# EAGLE design ValveDriver-8ch (EAGLE 9.1.1)
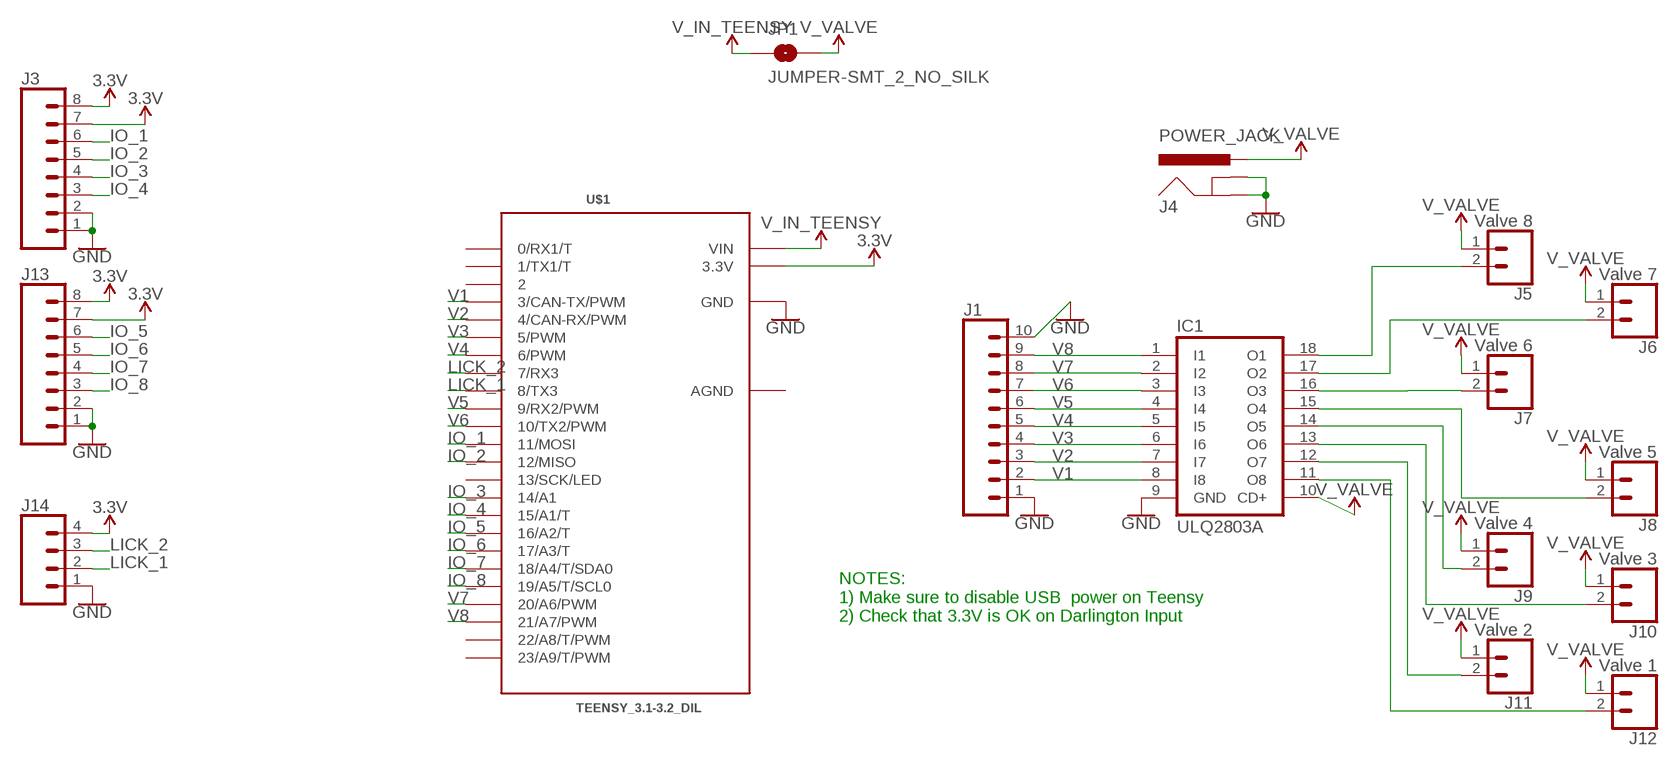
[diagram p0: schematic, sheet 1]

## Parts
IC1  ULQ2803A  ULN2803A  [DIL18]
J1  CONN_10"  [1X10]
J3  CONN_083.5MM-8  [SCREWTERMINAL-3.5MM-8]
J4  POWER_JACK  [POWER_JACK_PTH]
J5  Valve 8  CONN_02  [1X02]
J6  Valve 7  CONN_02  [1X02]
J7  Valve 6  CONN_02  [1X02]
J8  Valve 5  CONN_02  [1X02]
J9  Valve 4  CONN_02  [1X02]
J10  Valve 3  CONN_02  [1X02]
J11  Valve 2  CONN_02  [1X02]
J12  Valve 1  CONN_02  [1X02]
J13  CONN_083.5MM-8  [SCREWTERMINAL-3.5MM-8]
J14  CONN_04  [1X04]
JP1  JUMPER-SMT_2_NO_SILK  [SMT-JUMPER_2_NO_SILK]
U$1  TEENSY_3.1-3.2_DIL  [TEENSY_3.0-3.2&LC_DIL]

## Nets
3.3V: J3.7 J3.8 J13.7 J13.8 J14.4 U$1.3.3V
GND [power]: IC1.9(GND) J1.1 J1.10 J3.1 J3.2 J4.GND J4.GNDBREAK J13.1 J13.2 J14.1 U$1.GND
IO_1: J3.6 U$1.11(11/MOSI)
IO_2: J3.5 U$1.12(12/MISO)
IO_3: J3.4 U$1.14/A0(14/A1)
IO_4: J3.3 U$1.15/A1(15/A1/T)
IO_5: J13.6 U$1.16/A2(16/A2/T)
IO_6: J13.5 U$1.17/A3(17/A3/T)
IO_7: J13.4 U$1.18/A4(18/A4/T/SDA0)
IO_8: J13.3 U$1.19/A5(19/A5/T/SCL0)
LICK_1: J14.2 U$1.8(8/TX3)
LICK_2: J14.3 U$1.7(7/RX3)
N$1 [power]: IC1.18(O1) J5.2
N$2 [power]: IC1.17(O2) J6.2
N$3 [power]: IC1.16(O3) J7.2
N$4 [power]: IC1.15(O4) J8.2
N$5 [power]: IC1.14(O5) J9.2
N$6 [power]: IC1.13(O6) J10.2
N$7 [power]: IC1.12(O7) J11.2
N$8 [power]: IC1.11(O8) J12.2
V1: IC1.8(I8) J1.2 U$1.3(3/CAN-TX/PWM)
V2: IC1.7(I7) J1.3 U$1.4(4/CAN-RX/PWM)
V3: IC1.6(I6) J1.4 U$1.5(5/PWM)
V4: IC1.5(I5) J1.5 U$1.6(6/PWM)
V5: IC1.4(I4) J1.6 U$1.9(9/RX2/PWM)
V6: IC1.3(I3) J1.7 U$1.10(10/TX2/PWM)
V7: IC1.2(I2) J1.8 U$1.20/A6(20/A6/PWM)
V8: IC1.1(I1) J1.9 U$1.21/A7(21/A7/PWM)
V_IN_TEENSY: JP1.1 U$1.VIN
V_VALVE [power]: IC1.10(CD+) J4.PWR J5.1 J6.1 J7.1 J8.1 J9.1 J10.1 J11.1 J12.1 JP1.2
Unconnected: U$1.0(0/RX1/T) U$1.1(1/TX1/T) U$1.2 U$1.13(13/SCK/LED) U$1.22/A8(22/A8/T/PWM) U$1.23/A9(23/A9/T/PWM)

## Notes on the sheet
- NOTES:
  1) Make sure to disable USB  power on Teensy
  2) Check that 3.3V is OK on Darlington Input

## Power pins joined to a net without a drawn wire
AGND: U$1.AGND

## Library data of the parts
IC1 = uln-udn:ULN2803A: DRIVER ARRAY
J1 = SparkFun-Connectors:CONN_10: Multi connection point. Often used as Generic Header-pin footprint for 0.1 inch spaced/style header connections On any of the 0.1 inch spaced packages, you can populate with these: Break Away Headers - Straight <https://www.sparkfun.com/products/116> (PRT-00116) Break Away Male Headers - Right Angle <https://www.sparkfun.com/products/553> (PRT-00553) Female Headers <https://www.sparkfun.com/products/115> (PRT-00115) Break Away Headers - Machine Pin <https://www.sparkfun.com/products/117> (PRT-00117) Break Away Female Headers - Swiss Machine Pin <https://www.sparkfun.com/products/743> (PRT-00743) Arduino Stackable Header - 10 Pin <https://www.sparkfun.com/products/11376> (PRT-11376) For SCREWTERMINALS and SPRING TERMINALS visit here: Screw Terimnals on SparkFun.com <https://www.sparkfun.com/search/results?term=Screw+Terminals> (5mm/3.5mm/2.54mm spacing) This device is also useful as a general connection point to wire up your design to another part of your project. Our various solder wires solder well into these plated through hole pads. Hook-Up Wire - Assortment (Stranded, 22 AWG) <https://www.sparkfun.com/products/11375> (PRT-11375) Hook-Up Wire - Assortment (Solid Core, 22 AWG) <https://www.sparkfun.com/products/11367> (PRT-11367) View the entire wire category on our website here <https://www.sparkfun.com/categories/141> Special notes: Molex polarized connector foot print use with SKU : PRT-08231 with associated crimp pins and housings. 1MM SMD Version SKU: PRT-10208 NOTES ON THE VARIANTS LOCK and LOCK_LONGPADS... This footprint was designed to help hold the alignment of a through-hole component (i.e. 6-pin header) while soldering it into place. You may notice that each hole has been shifted either up or down by 0.005 of an inch from it's more standard position (which is a perfectly straight line). This slight alteration caused the pins (the squares in the middle) to touch the edges of the holes. Because they are alternating, it causes a "brace" to hold the component in place. 0.005 has proven to be the perfect amount of "off-center" position when using our standard breakaway headers. Although looks a little odd when you look at the bare footprint, once you have a header in there, the alteration is very hard to notice. Also,if you push a header all the way into place, it is covered up entirely on the bottom side.; PROD_ID: CONN-11563
J3 J13 = SparkFun-Connectors:CONN_08: Multi connection point. Often used as Generic Header-pin footprint for 0.1 inch spaced/style header connections On any of the 0.1 inch spaced packages, you can populate with these: Break Away Headers - Straight <https://www.sparkfun.com/products/116> (PRT-00116) Break Away Male Headers - Right Angle <https://www.sparkfun.com/products/553> (PRT-00553) Female Headers <https://www.sparkfun.com/products/115> (PRT-00115) Break Away Headers - Machine Pin <https://www.sparkfun.com/products/117> (PRT-00117) Break Away Female Headers - Swiss Machine Pin <https://www.sparkfun.com/products/743> (PRT-00743) Arduino Stackable Header - 8 Pin <https://www.sparkfun.com/products/9279> (PRT-09279) For SCREWTERMINALS and SPRING TERMINALS visit here: Screw Terimnals on SparkFun.com <https://www.sparkfun.com/search/results?term=Screw+Terminals> (5mm/3.5mm/2.54mm spacing) This device is also useful as a general connection point to wire up your design to another part of your project. Our various solder wires solder well into these plated through hole pads. Hook-Up Wire - Assortment (Stranded, 22 AWG) <https://www.sparkfun.com/products/11375> (PRT-11375) Hook-Up Wire - Assortment (Solid Core, 22 AWG) <https://www.sparkfun.com/products/11367> (PRT-11367) View the entire wire category on our website here <https://www.sparkfun.com/categories/141> Special notes: Molex polarized connector foot print use with SKU : PRT-08231 with associated crimp pins and housings. 1MM SMD Version SKU: PRT-10208 NOTES ON THE VARIANTS LOCK and LOCK_LONGPADS... This footprint was designed to help hold the alignment of a through-hole component (i.e. 6-pin header) while soldering it into place. You may notice that each hole has been shifted either up or down by 0.005 of an inch from it's more standard position (which is a perfectly straight line). This slight alteration caused the pins (the squares in the middle) to touch the edges of the holes. Because they are alternating, it causes a "brace" to hold the component in place. 0.005 has proven to be the perfect amount of "off-center" position when using our standard breakaway headers. Although looks a little odd when you look at the bare footprint, once you have a header in there, the alteration is very hard to notice. Also,if you push a header all the way into place, it is covered up entirely on the bottom side.
J4 = SparkFun-Connectors:POWER_JACK: Power Jack Connector This is the standard 5.5mm barrel jack for power. The PTH is the most common, proven, reliable, footprint. The Slot footprint only works if the mill layer is transmitted to the PCB fab house so be warned. Here are the connectors we sell at SparkFun: DC Barrel Power Jack/Connector <https://www.sparkfun.com/products/119> (PRT-00119) DC Barrel Power Jack/Connector (SMD) <https://www.sparkfun.com/products/12748> (PRT-12748) DC Barrel Jack Adapter - Breadboard Compatible <https://www.sparkfun.com/products/10811> (PRT-10811) It is used on this SparkFun product (and many, many others): SparkFun RedBoard - Programmed with Arduino <https://www.sparkfun.com/products/12757> (DEV-12757) Also, if you need a mating power supply or connector, please check these out: Wall Adapter Power Supply - 9VDC 650mA <https://www.sparkfun.com/products/298> (TOL-00298) DC Barrel Jack Adapter - Male <https://www.sparkfun.com/products/10287> (PRT-10287); PROD_ID: CONN-08197
J5-J12 = SparkFun-Connectors:CONN_02: Multi connection point. Often used as Generic Header-pin footprint for 0.1 inch spaced/style header connections On any of the 0.1 inch spaced packages, you can populate with these: Break Away Headers - Straight <https://www.sparkfun.com/products/116> (PRT-00116) Break Away Male Headers - Right Angle <https://www.sparkfun.com/products/553> (PRT-00553) Female Headers <https://www.sparkfun.com/products/115> (PRT-00115) Break Away Headers - Machine Pin <https://www.sparkfun.com/products/117> (PRT-00117) Break Away Female Headers - Swiss Machine Pin <https://www.sparkfun.com/products/743> (PRT-00743) For SCREWTERMINALS and SPRING TERMINALS visit here: Screw Terimnals on SparkFun.com <https://www.sparkfun.com/search/results?term=Screw+Terminals> (5mm/3.5mm/2.54mm spacing) This device is also useful as a general connection point to wire up your design to another part of your project. Our various solder wires solder well into these plated through hole pads. Hook-Up Wire - Assortment (Stranded, 22 AWG) <https://www.sparkfun.com/products/11375> (PRT-11375) Hook-Up Wire - Assortment (Solid Core, 22 AWG) <https://www.sparkfun.com/products/11367> (PRT-11367) View the entire wire category on our website here <https://www.sparkfun.com/categories/141> Special notes: Molex polarized connector foot print use with: PRT-08233 with associated crimp pins and housings. 2.54_SCREWTERM for use with PRT-10571. 3.5mm Screw Terminal footprints for PRT-08084 5mm Screw Terminal footprints for use with PRT-08432
J14 = SparkFun-Connectors:CONN_04: Multi connection point. Often used as Generic Header-pin footprint for 0.1 inch spaced/style header connections On any of the 0.1 inch spaced packages, you can populate with these: Break Away Headers - Straight <https://www.sparkfun.com/products/116> (PRT-00116) Break Away Male Headers - Right Angle <https://www.sparkfun.com/products/553> (PRT-00553) Female Headers <https://www.sparkfun.com/products/115> (PRT-00115) Break Away Headers - Machine Pin <https://www.sparkfun.com/products/117> (PRT-00117) Break Away Female Headers - Swiss Machine Pin <https://www.sparkfun.com/products/743> (PRT-00743) For SCREWTERMINALS and SPRING TERMINALS visit here: Screw Terimnals on SparkFun.com <https://www.sparkfun.com/search/results?term=Screw+Terminals> (5mm/3.5mm/2.54mm spacing) This device is also useful as a general connection point to wire up your design to another part of your project. Our various solder wires solder well into these plated through hole pads. Hook-Up Wire - Assortment (Stranded, 22 AWG) <https://www.sparkfun.com/products/11375> (PRT-11375) Hook-Up Wire - Assortment (Solid Core, 22 AWG) <https://www.sparkfun.com/products/11367> (PRT-11367) View the entire wire category on our website here <https://www.sparkfun.com/categories/141> Special notes: Molex polarized connector foot print use with SKU : PRT-08231 with associated crimp pins and housings. 1MM SMD Version SKU: PRT-10208; PROD_ID: CONN-09696
JP1 = SparkFun-Jumpers:JUMPER-SMT_2_NO: Normally open jumper This jumper has two pads in close proximity to each other. Apply solder to close the connection. Round pads are easier to solder for beginners, but are a lot larger. SparkFun Product that uses the round pads: SparkFun EL Sequencer <https://www.sparkfun.com/products/12781>
U$1 = Teensy_3_and_LC_Series_Boards_v1.4:TEENSY_3.1-3.2_DIL: Teensy 3.1 or 3.2 in a DIL Layout.

## Net classes
0 default: width 0.305 mm, clearance 0.305 mm
1 power: width 0.61 mm, clearance 0.254 mm

## Board
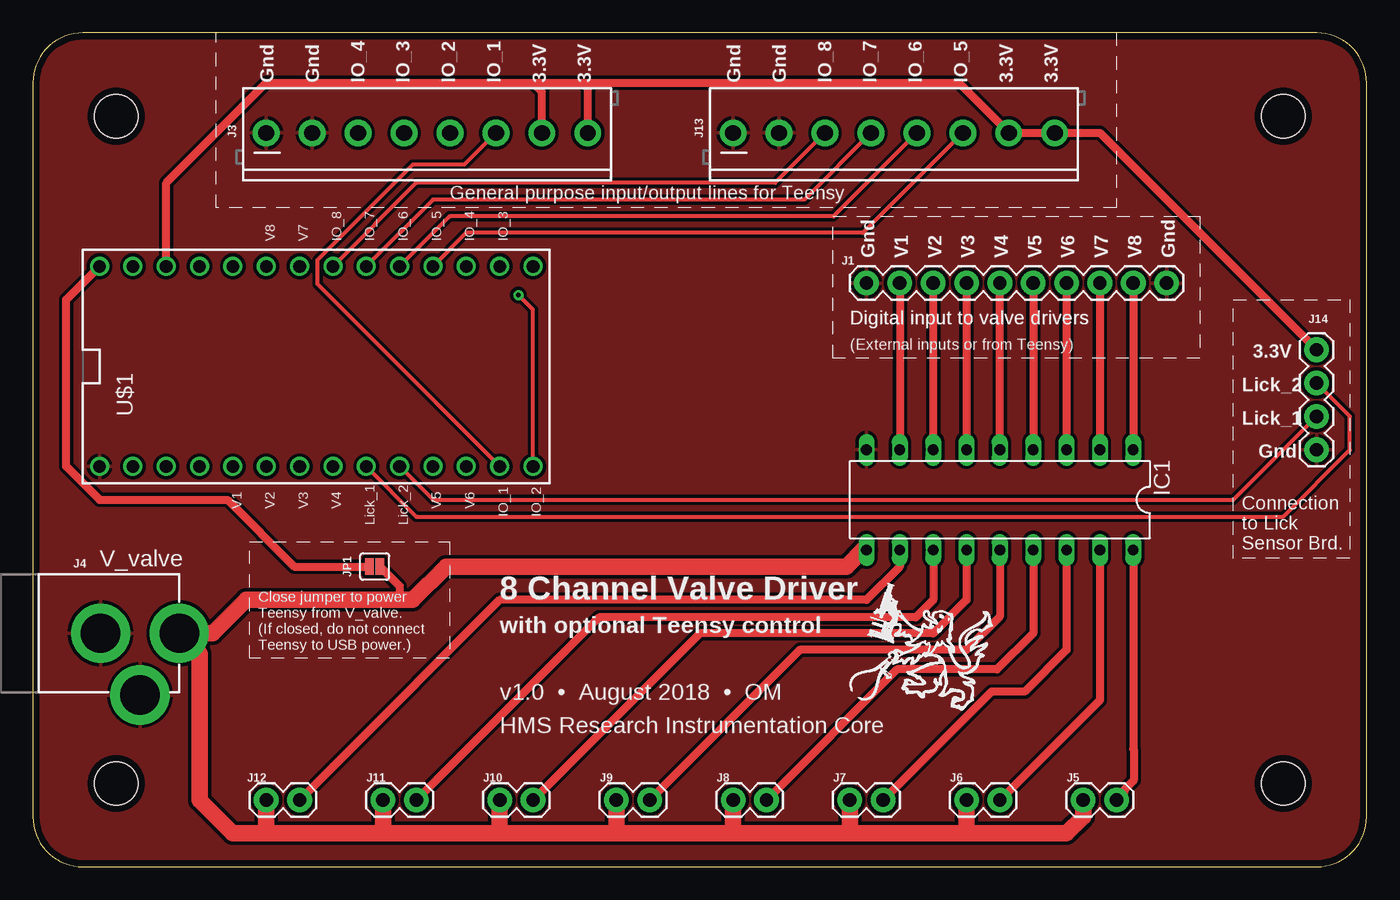
[diagram p1: board, top side]
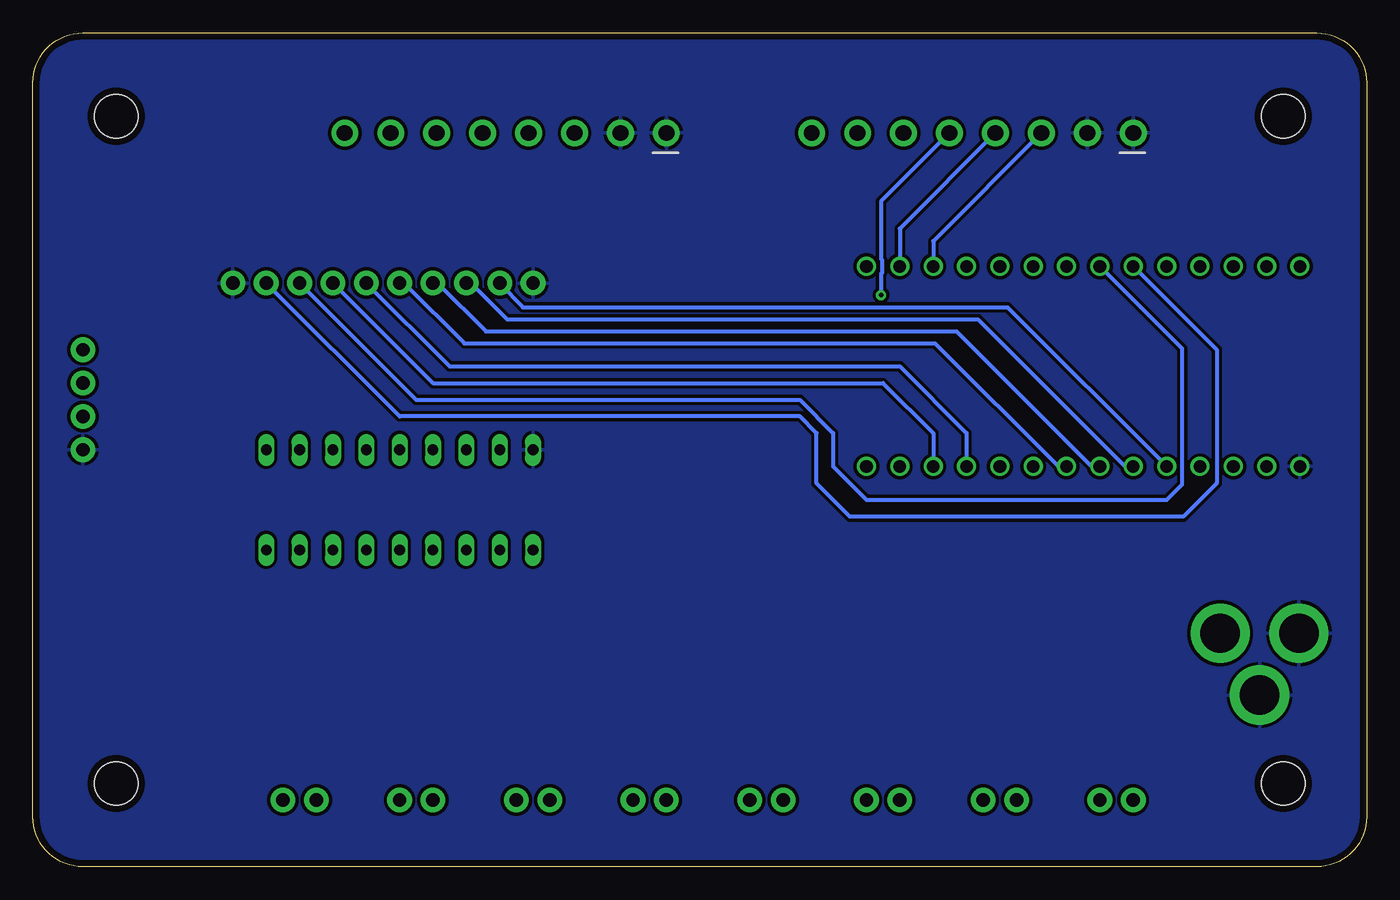
[diagram p2: board, bottom side, seen from below]

Size 101.6 x 63.5 mm. Coordinates in mm from the lower left corner, seen from the top.
Outline: 0,59.69 0,3.81 arc90 3.81,0 97.79,0 arc90 101.6,3.81 101.6,59.69 arc90 97.79,63.5 3.81,63.5 arc90 0,59.69
Copper layers (1*16): Top 0.0178mm / dielectric 59mil / Bottom 0.0178mm
Design rules "SSC-EAGLE-2Lyr_v1.0.0.3": minimum track width 6mil, minimum drill 14mil, track to track 6mil, track to pad 6mil, pad to pad 6mil, via to via 6mil, smd to smd 6mil, copper to edge 20mil, drill to drill 16mil, minimum pad ring 8mil, minimum via ring 8mil, stop-mask expansion 3mil, vias tented up to drill 0mil, thermal gap 10mil

### Footprints (pad centres in the part's own frame; a part is rotated, then mirrored left to right if it is on the bottom)
DIL18 = drill 0.813 long: 1 -10.16,-3.81; 2 -7.62,-3.81; 3 -5.08,-3.81; 4 -2.54,-3.81; 5 0,-3.81; 6 2.54,-3.81; 7 5.08,-3.81; 8 7.62,-3.81; 9 10.16,-3.81; 10 10.16,3.81; 11 7.62,3.81; 12 5.08,3.81; 13 2.54,3.81; 14 0,3.81; 15 -2.54,3.81; 16 -5.08,3.81; 17 -7.62,3.81; 18 -10.16,3.81
1X10 = drill 1.016 pad 1.88: 1 0,0; 2 2.54,0; 3 5.08,0; 4 7.62,0; 5 10.16,0; 6 12.7,0; 7 15.24,0; 8 17.78,0; 9 20.32,0; 10 22.86,0
SCREWTERMINAL-3.5MM-8 = drill 1.2 pad 2.032: 1 0,0; 2 3.5,0; 3 7,0; 4 10.5,0; 5 14,0; 6 17.5,0; 7 21,0; 8 24.5,0
POWER_JACK_PTH = drill 2.997 pad 4.318: GND 0,7.7; GNDBREAK 4.7,10.7; PWR 0,13.7
1X02 = drill 1.016 pad 1.88: 1 0,0; 2 2.54,0
1X04 = drill 1.016 pad 1.88: 1 0,0; 2 2.54,0; 3 5.08,0; 4 7.62,0
SMT-JUMPER_2_NO_SILK = smd 0.635 x 1.27: 1 -0.406,0; 2 0.406,0
TEENSY_3.0-3.2&LC_DIL = drill 0.965: 0 -7.62,13.97; 1 -7.62,11.43; 2 -7.62,8.89; 3 -7.62,6.35; 3.3V 7.62,11.43; 4 -7.62,3.81; 5 -7.62,1.27; 6 -7.62,-1.27; 7 -7.62,-3.81; 8 -7.62,-6.35; 9 -7.62,-8.89; 10 -7.62,-11.43; 11 -7.62,-13.97; 12 -7.62,-16.51; 13 7.62,-16.51; 14/A0 7.62,-13.97; 15/A1 7.62,-11.43; 16/A2 7.62,-8.89; 17/A3 7.62,-6.35; 18/A4 7.62,-3.81; 19/A5 7.62,-1.27; 20/A6 7.62,1.27; 21/A7 7.62,3.81; 22/A8 7.62,6.35; 23/A9 7.62,8.89; AGND 7.62,13.97; GND -7.62,16.51; VIN 7.62,16.51
STAND-OFF = hole 3.302: 0,0

### Placement (x,y rotation side)
IC1  73.66,27.94 180 top
J1  63.5,44.45 0 top
J3  17.78,55.88 0 top
J4  -2.54,17.78 270 top
J5  80.01,5.08 0 top
J6  71.12,5.08 0 top
J7  62.23,5.08 0 top
J8  53.34,5.08 0 top
J9  44.45,5.08 0 top
J10  35.56,5.08 0 top
J11  26.67,5.08 0 top
J12  17.78,5.08 0 top
J13  53.34,55.88 0 top
J14  97.79,31.75 90 top
JP1  26.04,22.86 0 top
U$1  21.59,38.1 90 top
U$2  [STAND-OFF]  95.25,57.15 0 top
U$3  [RIC_LOGO_MED]  62.23,11.89 0 top
U$4  [STAND-OFF]  95.25,6.35 0 top
U$5  [STAND-OFF]  6.35,6.35 0 top
U$6  [STAND-OFF]  6.35,57.15 0 top

### Tracks (layer width: path | path; a pad name or v marks a point on that pad's centre or on a via)
3.3V
  Top 0.61: U$1.3.3V 10.16,52.07 17.78,59.69 38.1,59.69 | 38.1,59.69 41.91,59.69 | 41.91,59.69 70.53,59.69 J13.7 J13.8 81.28,55.88 J14.4 | J3.7 38.78,59.01 38.1,59.69 | J3.8 42.28,59.32 41.91,59.69
GND
  pour Bottom: 0,63.5 101.6,63.5 101.6,0 0,0
  pour Top: 0,63.5 101.6,63.5 101.6,0 0,0
IO_1
  Top 0.305: U$1.11 21.68,44.36 21.68,46.21 28.93,53.46 32.86,53.46 J3.6
IO_2  (via drill 0.36)
  Top 0.305: v36.99,43.53 38.1,42.42 U$1.12
  Bottom 0.305: J3.5 36.99,50.67 36.99,46.28 36.92,46.21 36.92,45.23 36.99,45.16 v36.99,43.53
IO_3
  Bottom 0.305: J3.4 35.56,48.6 U$1.14/A0
IO_4
  Bottom 0.305: J3.3 33.02,47.64 U$1.15/A1
IO_5
  Top 0.305: J13.6 63.22,48.26 33.02,48.26 U$1.16/A2
IO_6
  Top 0.305: J13.5 60.99,49.53 31.75,49.53 U$1.17/A3
IO_7
  Top 0.305: J13.4 58.76,50.8 30.48,50.8 U$1.18/A4
IO_8
  Top 0.305: J13.3 56.53,52.07 29.21,52.07 U$1.19/A5
LICK_1
  Top 0.305: U$1.8 30.48,27.94 91.44,27.94 J14.2
LICK_2
  Top 0.305: U$1.7 29.21,26.67 95.25,26.67 100.33,31.75 100.33,34.29 J14.3
N$1
  Top 0.61: IC1.18 83.82,8.97 83.86,8.93 83.86,6.58 83.13,5.85 83.13,5.66 J5.2
N$2
  Top 0.61: IC1.17 81.28,12.7 J6.2
N$3
  Top 0.61: IC1.16 78.74,16.51 75.56,13.34 73.03,13.34 J7.2
N$4
  Top 0.61: IC1.15 76.2,17.78 73.45,15.03 65.83,15.03 J8.2
N$5
  Top 0.61: IC1.14 73.66,19.05 71.12,16.51 58.42,16.51 J9.2
N$6
  Top 0.61: IC1.13 71.12,20.32 68.58,17.78 50.8,17.78 J10.2
N$7
  Top 0.61: IC1.12 68.58,20.32 67.26,19 43.13,19 J11.2
N$8
  Top 0.61: IC1.11 66.04,22.86 63.5,20.32 35.56,20.32 22.86,7.62 J12.2
V1
  Top 0.61: J1.2 IC1.8
  Bottom 0.305: U$1.3 27.36,42.6 64.27,42.6 J1.2
V2
  Top 0.61: IC1.7 J1.3
  Bottom 0.305: J1.3 68.23,44.45 65.46,41.68 29.62,41.68 18.42,30.48 U$1.4
V3
  Top 0.61: J1.4 IC1.6
  Bottom 0.305: J1.4 70.77,44.45 67.09,40.77 31.24,40.77 20.96,30.48 U$1.5
V4
  Top 0.61: IC1.5 J1.5
  Bottom 0.305: J1.5 73.31,44.45 68.71,39.85 32.87,39.85 23.5,30.48 U$1.6
V5
  Top 0.61: J1.6 IC1.4
  Bottom 0.305: J1.6 69.85,38.1 35.56,38.1 30.48,33.02 U$1.9
V6
  Top 0.61: J1.7 IC1.3
  Bottom 0.305: J1.7 71.12,36.83 36.83,36.83 33.02,33.02 U$1.10
V7
  Top 0.61: J1.8 IC1.2
  Bottom 0.305: J1.8 72.39,35.56 43.18,35.56 40.64,33.02 40.64,30.48 38.1,27.94 15.24,27.94 14.06,29.12 14.06,39.46 U$1.20/A6
V8
  Top 0.61: J1.9 IC1.1
  Bottom 0.305: U$1.21/A7 11.43,39.37 11.43,29.21 13.97,26.67 39.37,26.67 41.91,29.21 41.91,33.02 43.18,34.29 73.66,34.29 J1.9
V_IN_TEENSY
  Top 0.61: U$1.VIN 2.54,43.18 2.54,30.48 5.08,27.94 14.83,27.94 19.91,22.86 JP1.1
V_VALVE
  Top 0.61: JP1.2 27.94,21.36 27.94,20.32
  Top 1.27: 35.56,2.54 44.45,2.54 | 44.45,2.54 53.34,2.54 | 53.34,2.54 62.23,2.54 | 62.23,2.54 71.12,2.54 | 71.12,2.54 78.74,2.54 80.01,3.81 J5.1 | J6.1 71.12,2.54 | J7.1 62.23,2.54 | J10.1 35.56,2.54 | IC1.10 63.23,24.13 61.96,22.86 31.48,22.86 28.94,20.32 27.94,20.32 16.24,20.32 13.7,17.78 J4.PWR 12.7,16.24 12.7,5.08 15.24,2.54 17.78,2.54 | 17.78,2.54 26.67,2.54 | 26.67,2.54 35.56,2.54 | J9.1 44.45,2.54 | J8.1 53.34,2.54 | J11.1 26.67,2.54 | J12.1 17.78,2.54

### Text on the board
tPlace: Gnd / Gnd / IO_4 / IO_3 / IO_2 / IO_1 / 3.3V / 3.3V | Gnd / Gnd / IO_8 / IO_7 / IO_6 / IO_5 / 3.3V / 3.3V | General purpose input/output lines for Teensy | V8 / V7 / IO_8 / IO_7 / IO_6 / IO_5 / IO_4 / IO_3 | Gnd / V1 / V2 / V3 / V4 / V5 / V6 / V7 / V8 / Gnd | Digital input to valve drivers | Digital input to valve drivers | (External inputs or from Teensy) | 3.3V / Lick_2 / Lick_1 / Gnd | V1 / V2 / V3 / V4 / Lick_1 / Lick_2 / V5 / V6 / IO_1 / IO_2 | Connection / to Lick / Sensor Brd. | V_valve | 8 Channel Valve Driver | with optional Teensy control | Close jumper to power / Teensy from V_valve. / (If closed, do not connect / Teensy to USB power.) | v1.0 • August 2018 • OM | HMS Research Instrumentation Core